# EasyEDA schematic ESP32.json
TITLE: PCB_ESP32; REV: 1.0; Date: 2026-06-04; Sheet: 1/1; Company: Your Company
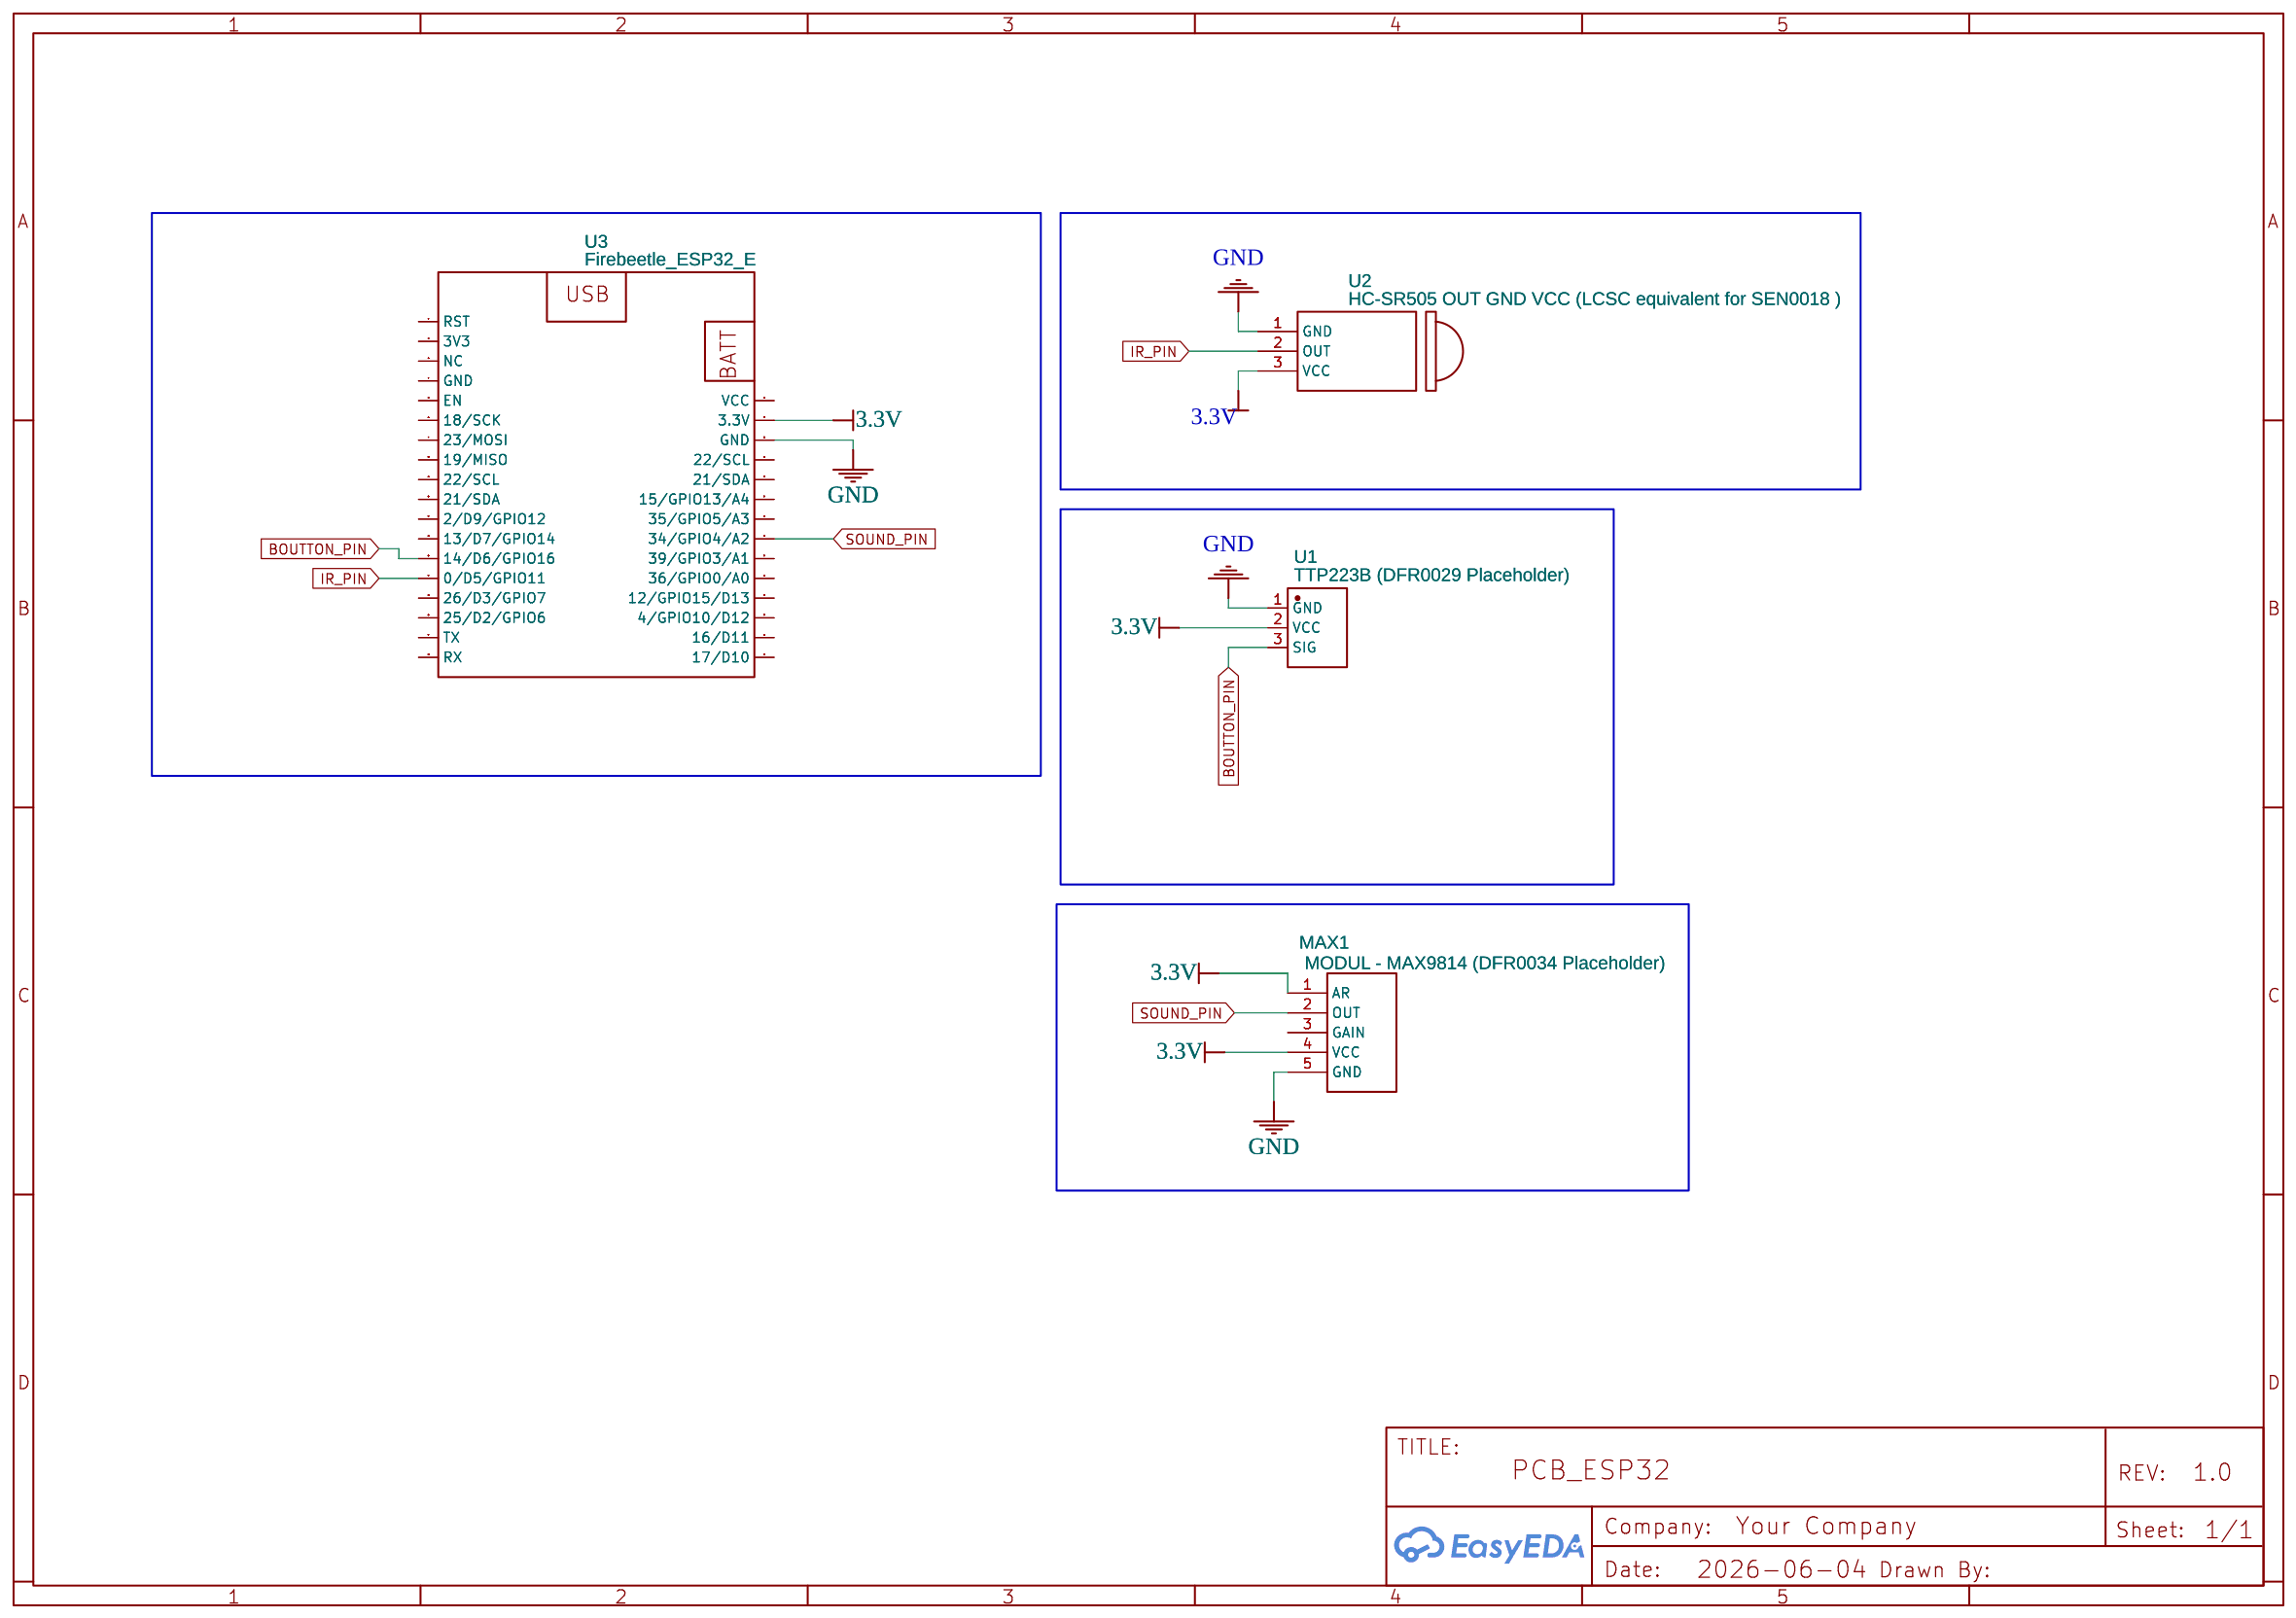
[diagram p0: schematic sheet]

## Parts
MAX1  MODUL - MAX9814 (DFR0034 Placeholder)  [MODUL - MAX9814]
U1  TTP223B (DFR0029 Placeholder)  [TTP223B CAPACITIVE DIGITAL TOUCH SENSOR TOUCH BUTTON MODULE]
U2  HC-SR505 OUT GND VCC (LCSC equivalent for SEN0018 )  [HC-SR505]
U3  Firebeetle_ESP32_E  [FIREBEETLE_ESP32_E_FOOTPRINT]

## Library data of the parts
MAX1 = MODUL - MAX9814: sourceId: 1T5FDZYC8; Contributor: kaykeo6
U1 = TTP223B: Contributor: sunyecz22
U2 = HC-SR505 OUT GND VCC: Contributor: lght
U3 = Firebeetle_ESP32_E: Manufacturer: DFRobot; Manufacturer Part: DFR0654; Supplier: DFRobot; Supplier Part: DFR0654; link: https://www.dfrobot.com/product-2195.html; Contributor: goldenoldie

## Nets
3.3V: MAX1.1(AR) MAX1.4(VCC) U1.2(VCC) U2.3(VCC) U3.31(3.3V)
GND: MAX1.5(GND) U1.1(GND) U2.1(GND) U3.30(GND)
BOUTTON_PIN: U1.3(SIG) U3.13(14/D6/GPIO16)
IR_PIN: U2.2(OUT) U3.14(0/D5/GPIO11)
SOUND_PIN: MAX1.2(OUT) U3.25(34/GPIO4/A2)

Not connected (* = marked no-connect by the designer): MAX1 3(GAIN); U3 1(RST) 2(3V3) 3(NC) 4(GND) 5(EN) 6(18/SCK) 7(23/MOSI) 8(19/MISO) 9(22/SCL) 10(21/SDA) 11(2/D9/GPIO12) 12(13/D7/GPIO14) 15(26/D3/GPIO7) 16(25/D2/GPIO6) 17(TX) 18(RX) 19(17/D10) 20(16/D11) 21(4/GPIO10/D12) 22(12/GPIO15/D13) 23(36/GPIO0/A0) 24(39/GPIO3/A1) 26(35/GPIO5/A3) 27(15/GPIO13/A4) 28(21/SDA) 29(22/SCL) 32(VCC)
